# EAGLE design USB Multiplicator (EAGLE 7.6.0)
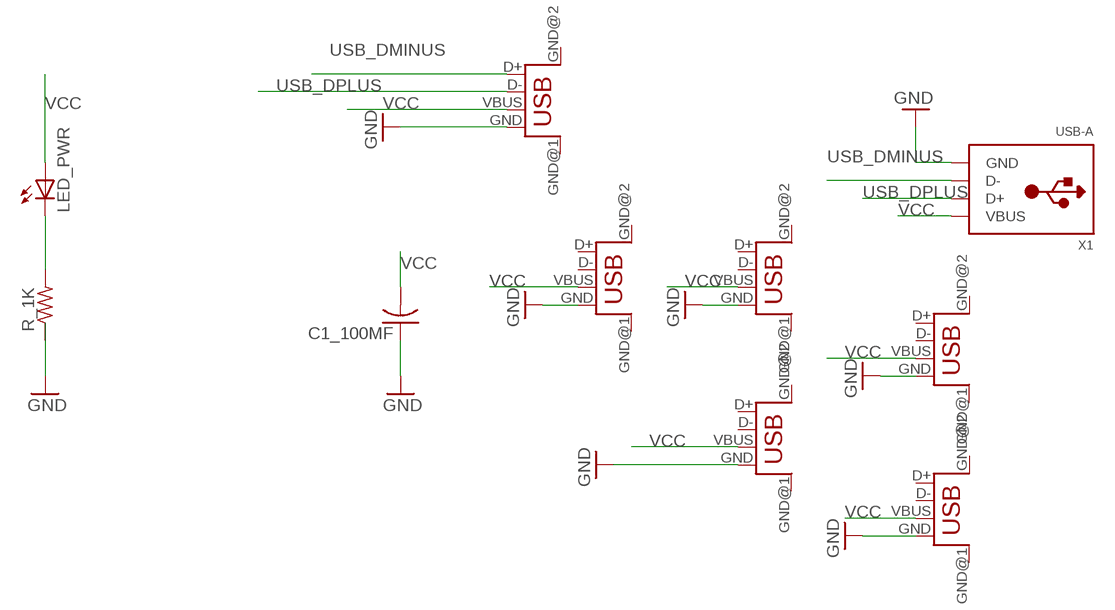
[diagram p0: schematic, sheet 1]

## Parts
C1_100MF  C-US025-030X050  [C025-030X050]
LED_PWR  LEDSMT1206  [1206]
R_1K  R-US_R1206  [R1206]
USB_OUT_2  USB  [USB-FEMALE-A-PTH]
USB_OUT_3  USB  [USB-FEMALE-A-PTH]
USB_OUT_4  USB  [USB-FEMALE-A-PTH]
USB_OUT_5  USB  [USB-FEMALE-A-PTH]
USB_OUT_6  USB  [USB-FEMALE-A-PTH]
USB_OUT_WITH_DATA_1  USB  [USB-FEMALE-A-PTH]
X1  USB-A  [MOLEX_480371000]

## Nets
GND: C1_100MF.1 R_1K.1 USB_OUT_2.GND USB_OUT_3.GND USB_OUT_4.GND USB_OUT_5.GND USB_OUT_6.GND USB_OUT_WITH_DATA_1.GND X1.4(GND)
N$5: LED_PWR.C R_1K.2
USB_DMINUS: USB_OUT_WITH_DATA_1.D+ X1.2(D-)
USB_DPLUS: USB_OUT_WITH_DATA_1.D- X1.3(D+)
VCC: C1_100MF.2 LED_PWR.A USB_OUT_2.VBUS USB_OUT_3.VBUS USB_OUT_4.VBUS USB_OUT_5.VBUS USB_OUT_6.VBUS USB_OUT_WITH_DATA_1.VBUS X1.1(VBUS)
Unconnected: USB_OUT_2.D+ USB_OUT_2.D- USB_OUT_2.GND@1(GND) USB_OUT_2.GND@2(GND) USB_OUT_3.D+ USB_OUT_3.D- USB_OUT_3.GND@1(GND) USB_OUT_3.GND@2(GND) USB_OUT_4.D+ USB_OUT_4.D- USB_OUT_4.GND@1(GND) USB_OUT_4.GND@2(GND) USB_OUT_5.D+ USB_OUT_5.D- USB_OUT_5.GND@1(GND) USB_OUT_5.GND@2(GND) USB_OUT_6.D+ USB_OUT_6.D- USB_OUT_6.GND@1(GND) USB_OUT_6.GND@2(GND) USB_OUT_WITH_DATA_1.GND@1(GND) USB_OUT_WITH_DATA_1.GND@2(GND)

## Library data of the parts
C1_100MF = adafruit:C-US: CAPACITOR, American symbol
LED_PWR = adafruit:LED: LED OSRAM: - CHIPLED LG R971, LG N971, LY N971, LG Q971, LY Q971, LO R971, LY R971 LH N974, LH R974 LS Q976, LO Q976, LY Q976 LO Q996 - Hyper CHIPLED LW Q18S LB Q993, LB Q99A, LB R99A - SideLED LS A670, LO A670, LY A670, LG A670, LP A670 LB A673, LV A673, LT A673, LW A673 LH A674 LY A675 LS A676, LA A676, LO A676, LY A676, LW A676 LS A679, LY A679, LG A679 - Hyper Micro SIDELED® LS Y876, LA Y876, LO Y876, LY Y876 LT Y87S - SmartLED LW L88C, LW L88S LB L89C, LB L89S, LG L890 LS L89K, LO L89K, LY L89K LS L896, LA L896, LO L896, LY L896 - TOPLED LS T670, LO T670, LY T670, LG T670, LP T670 LSG T670, LSP T670, LSY T670, LOP T670, LYG T670 LG T671, LOG T671, LSG T671 LB T673, LV T673, LT T673, LW T673 LH T674 LS T676, LA T676, LO T676, LY T676, LB T676, LH T676, LSB T676, LW T676 LB T67C, LV T67C, LT T67C, LS T67K, LO T67K, LY T67K, LW E67C LS E67B, LA E67B, LO E67B, LY E67B, LB E67C, LV E67C, LT E67C LW T67C LS T679, LY T679, LG T679 LS T770, LO T770, LY T770, LG T770, LP T770 LB T773, LV T773, LT T773, LW T773 LH T774 LS E675, LA E675, LY E675, LS T675 LS T776, LA T776, LO T776, LY T776, LB T776 LHGB T686 LT T68C, LB T68C - Hyper Mini TOPLED® LB M676 - Mini TOPLED Santana® LG M470 LS M47K, LO M47K, LY M47K Source: http://www.osram.convergy.de/
R_1K = adafruit:R-US_: RESISTOR, American symbol
USB_OUT_2-USB_OUT_6 USB_OUT_WITH_DATA_1 = STUNTAZ:USB: USB Connectors USB-FEMALE-A-PTH: Through hole Female Type A Connector
X1 = adafruit:USB-A: USB type A 'plug' Used for things that can directly connect to a USB port, say USB key

## Board
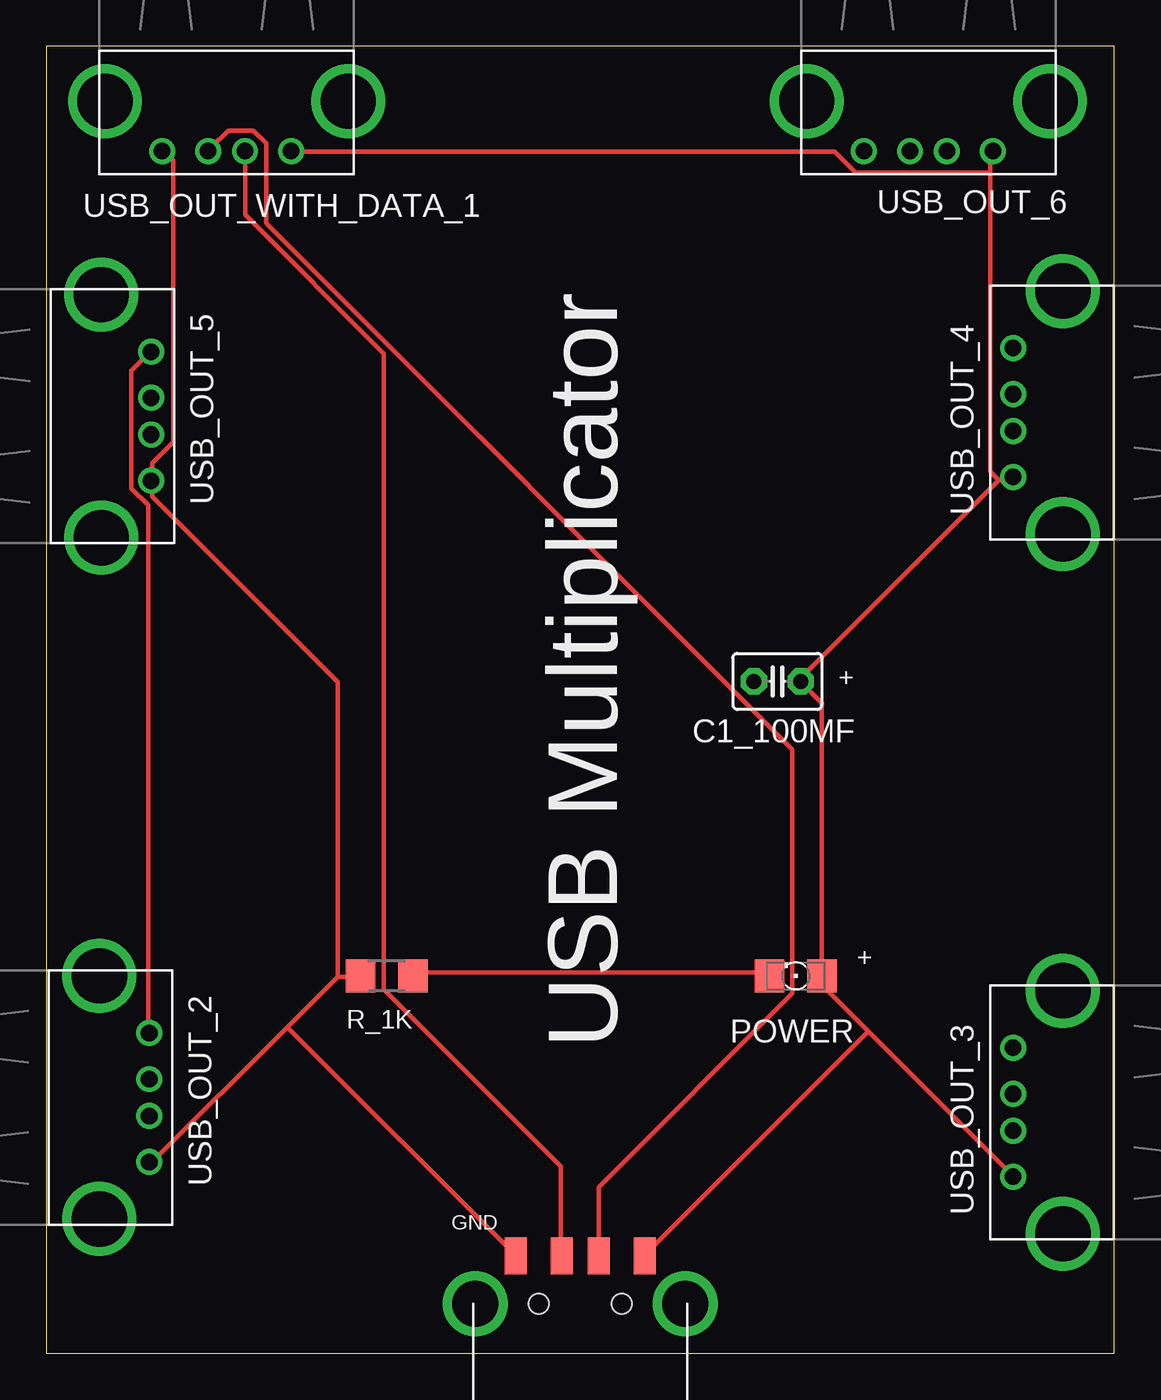
[diagram p1: board, top side]
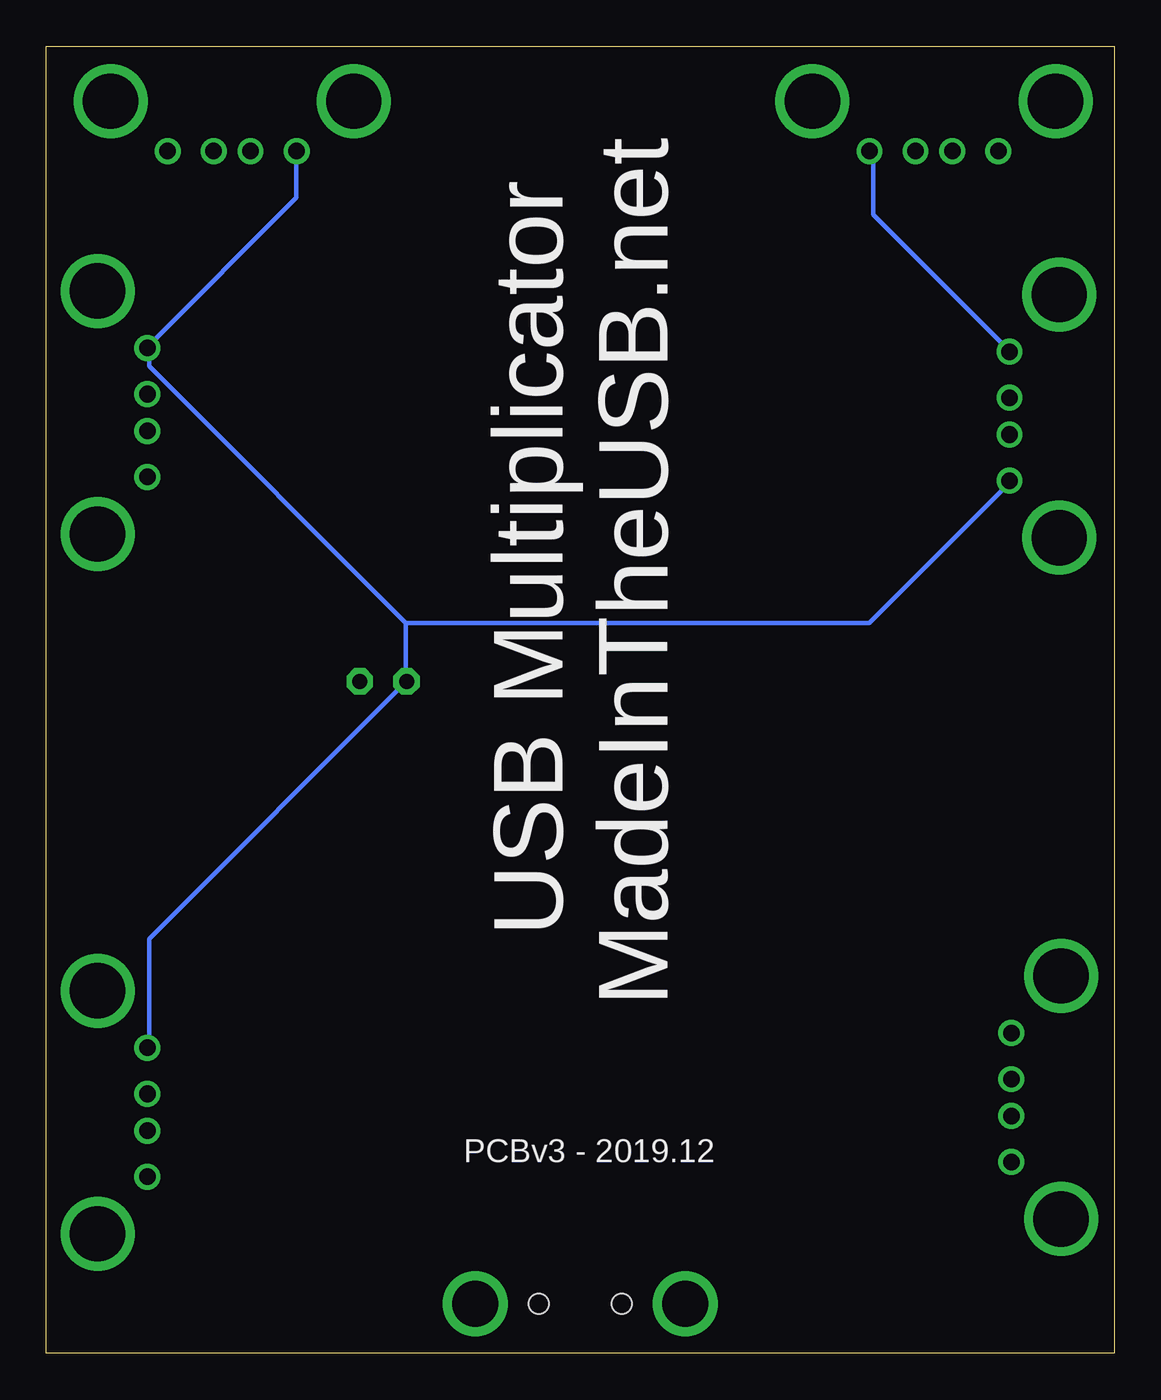
[diagram p2: board, bottom side, seen from below]

Size 58 x 71 mm. Coordinates in mm from the lower left corner, seen from the top.
Outline: 0,0 58,0 58,71 0,71 0,0
Copper layers (1*16): Top 0.035mm / dielectric 1.5mm / Bottom 0.035mm
Design rules "default": minimum track width 10mil, minimum drill 24mil, track to track 8mil, track to pad 8mil, pad to pad 8mil, via to via 8mil, smd to smd 8mil, copper to edge 40mil, drill to drill 8mil, minimum pad ring 10mil, minimum via ring 8mil, stop-mask expansion 4mil, vias tented up to drill 0mil, thermal gap 10mil

### Footprints (pad centres in the part's own frame; a part is rotated, then mirrored left to right if it is on the bottom)
C025-030X050 = drill 0.813 pad 1.422 octagon: 1 -1.27,0; 2 1.27,0
1206 = smd 1.6 x 1.803: A -1.422,0; C 1.422,0
R1206 = smd 1.6 x 1.803: 1 -1.422,0; 2 1.422,0
USB-FEMALE-A-PTH = drill 0.9: D+ 5.9,1.3; D- 7.9,1.3; GND 3.4,1.3; VBUS 10.4,1.3 | drill 3: GND@1 13.5,4; GND@2 0.3,4
MOLEX_480371000 = smd 1.2 x 2: 1 3.5,2.6; 2 1,2.6; 3 -1,2.6; 4 -3.5,2.6 | drill 2.5: M1 -5.7,0; M2 5.7,0 | hole 1.1: -2.25,0; 2.25,0

### Placement (x,y rotation side)
C1_100MF  39.7,36.5 0 top
LED_PWR  40.7,20.5 180 top
R_1K  18.5,20.5 0 top
USB_OUT_2  6.9,7 90 top
USB_OUT_3  51.2,20 270 top
USB_OUT_4  51.2,58 270 top
USB_OUT_5  7,44 90 top
USB_OUT_6  41,64 0 top
USB_OUT_WITH_DATA_1  2.9,64 0 top
X1  29,2.7 0 top

### Tracks (layer width: path | path; a pad name or v marks a point on that pad's centre or on a via)
GND
  Top 0.254: USB_OUT_WITH_DATA_1.GND 6.46,65.27 6.91,64.81 6.91,49.49 5.77,48.35 5.77,47.44 USB_OUT_5.GND 5.77,47.21 5.77,46.52 15.83,36.46 15.83,20.46 | 15.83,20.46 16.97,20.46 R_1K.1 | 13.09,17.72 5.77,10.4 USB_OUT_2.GND | 13.09,17.72 15.83,20.46 | 13.09,17.72 25.43,5.37 X1.4
  Bottom 0.254: USB_OUT_6.GND 44.41,65.27 44.41,62.75 52.41,54.75 USB_OUT_4.GND 52.41,54.52 52.41,53.61 38.46,39.66 | USB_OUT_3.GND 52.41,16.8 52.41,22.52 38.46,36.46 C1_100MF.1 38.46,36.69 38.46,39.66 | 38.46,39.66 13.32,39.66 5.77,47.21 USB_OUT_5.GND
N$5
  Top 0.254: R_1K.2 19.95,20.69 39.15,20.69 LED_PWR.C
USB_DMINUS
  Top 0.254: X1.2 30,5.37 30,9.03 40.52,19.55 40.52,32.81 11.95,61.38 11.95,65.72 11.26,66.41 9.89,66.41 8.97,65.5 USB_OUT_WITH_DATA_1.D+
USB_DPLUS
  Top 0.254: X1.3 27.95,5.37 27.95,10.17 18.34,19.77 18.34,54.29 10.8,61.84 10.8,65.27 USB_OUT_WITH_DATA_1.D-
VCC
  Top 0.254: USB_OUT_2.VBUS 5.54,17.49 5.54,46.06 4.63,46.98 4.63,53.38 5.54,54.29 USB_OUT_5.VBUS | 44.63,17.49 52.41,9.72 USB_OUT_3.VBUS | 44.63,17.49 42.35,19.77 42.35,20.46 LED_PWR.A 42.12,20.69 42.12,35.32 40.98,36.46 C1_100MF.2 40.98,36.69 51.72,47.44 | 44.63,17.49 32.52,5.37 X1.1 | 51.72,47.44 52.41,47.44 USB_OUT_4.VBUS | 51.26,64.12 51.26,47.89 51.72,47.44 | 51.26,64.12 51.26,65.27 USB_OUT_6.VBUS | 51.26,64.12 43.95,64.12 42.81,65.27 13.32,65.27 USB_OUT_WITH_DATA_1.VBUS
  Bottom 0.254: USB_OUT_WITH_DATA_1.VBUS 13.09,65.27 13.09,61.84 5.77,54.52 USB_OUT_5.VBUS

### Text on the board
tNames: USB Multiplicator | + | + | POWER | GND
bNames: USB Multiplicator / MadeInTheUSB.net | PCBv3 - 2019.12